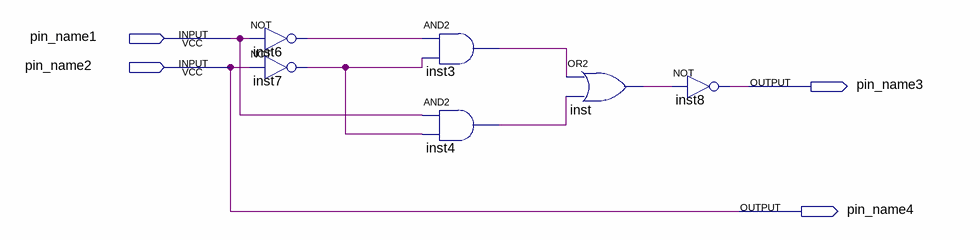
[diagram p0: schematic sheet]
// Quartus schematic gluing.bdf as structural Verilog: 6 symbols, 4 pins
module gluing (
  input  pin_name1,
  input  pin_name2,
  output pin_name3,
  output pin_name4
);

  wire inst3_out, inst4_out, inst6_out, inst7_out, inst_out;

  not inst6 (inst6_out, pin_name1);
  not inst7 (inst7_out, pin_name2);
  and inst3 (inst3_out, inst6_out, inst7_out);
  and inst4 (inst4_out, pin_name1, inst7_out);
  or inst (inst_out, inst3_out, inst4_out);
  not inst8 (pin_name3, inst_out);

  assign pin_name4 = pin_name2;
endmodule
